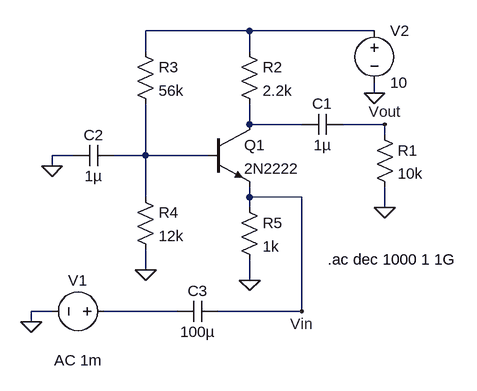
[diagram p0: schematic Draft11.asc]
Draft11.asc, the LTspice schematic file:
Version 4.1
SHEET 1 880 680
WIRE 208 -32 48 -32
WIRE 400 -32 208 -32
WIRE 48 0 48 -32
WIRE 208 0 208 -32
WIRE 400 64 400 48
WIRE 208 112 208 80
WIRE 288 112 208 112
WIRE 416 112 352 112
WIRE 416 128 416 112
WIRE -64 160 -96 160
WIRE 48 160 48 80
WIRE 48 160 0 160
WIRE 144 160 48 160
WIRE -96 176 -96 160
WIRE 48 224 48 160
WIRE 208 224 208 208
WIRE 288 224 208 224
WIRE 208 240 208 224
WIRE 416 240 416 208
WIRE 48 336 48 304
WIRE 208 352 208 320
WIRE -96 400 -128 400
WIRE 96 400 -16 400
WIRE 288 400 288 224
WIRE 288 400 160 400
WIRE -128 416 -128 400
FLAG 416 240 0
FLAG 48 336 0
FLAG 208 352 0
FLAG -96 176 0
FLAG -128 416 0
FLAG 288 400 Vin
FLAG 400 64 0
FLAG 416 112 Vout
SYMBOL npn 144 112 R0
SYMATTR InstName Q1
SYMATTR Value 2N2222
SYMBOL cap 352 96 R90
WINDOW 0 0 32 VBottom 2
WINDOW 3 32 32 VTop 2
SYMATTR InstName C1
SYMATTR Value 1µ
SYMBOL res 400 112 R0
SYMATTR InstName R1
SYMATTR Value 10k
SYMBOL res 192 -16 R0
SYMATTR InstName R2
SYMATTR Value 2.2k
SYMBOL res 32 -16 R0
SYMATTR InstName R3
SYMATTR Value 56k
SYMBOL res 32 208 R0
SYMATTR InstName R4
SYMATTR Value 12k
SYMBOL res 192 224 R0
SYMATTR InstName R5
SYMATTR Value 1k
SYMBOL cap 0 144 R90
WINDOW 0 0 32 VBottom 2
WINDOW 3 32 32 VTop 2
SYMATTR InstName C2
SYMATTR Value 1µ
SYMBOL voltage 0 400 R90
WINDOW 0 -32 56 VBottom 2
WINDOW 3 32 56 VTop 2
WINDOW 123 60 56 VTop 2
WINDOW 39 0 0 Left 0
SYMATTR InstName V1
SYMATTR Value ""
SYMATTR Value2 AC 1m
SYMBOL voltage 400 -48 R0
WINDOW 123 0 0 Left 0
WINDOW 39 0 0 Left 0
SYMATTR InstName V2
SYMATTR Value 10
SYMBOL cap 160 384 R90
WINDOW 0 0 32 VBottom 2
WINDOW 3 32 32 VTop 2
SYMATTR InstName C3
SYMATTR Value 100µ
TEXT 328 320 Left 2 !.ac dec 1000 1 1G

The netlist it stands for:
* Draft11.asc
Q1 N002 N003 Vin 0 2N2222
C1 Vout N002 1µ
R1 Vout 0 10k
R2 N001 N002 2.2k
R3 N001 N003 56k
R4 N003 0 12k
R5 Vin 0 1k
C2 N003 0 1µ
V1 N004 0 AC 1m
V2 N001 0 10
C3 Vin N004 100µ
.model NPN NPN
.model PNP PNP
.lib standard.bjt
.ac dec 1000 1 1G
.backanno
.end